# Altium project GN-1866-A-V2_HI3519V101.PRJPCB (part 4 of 4)

## Sheet P04 Power 1.SchDoc
size 420 x 297 mm
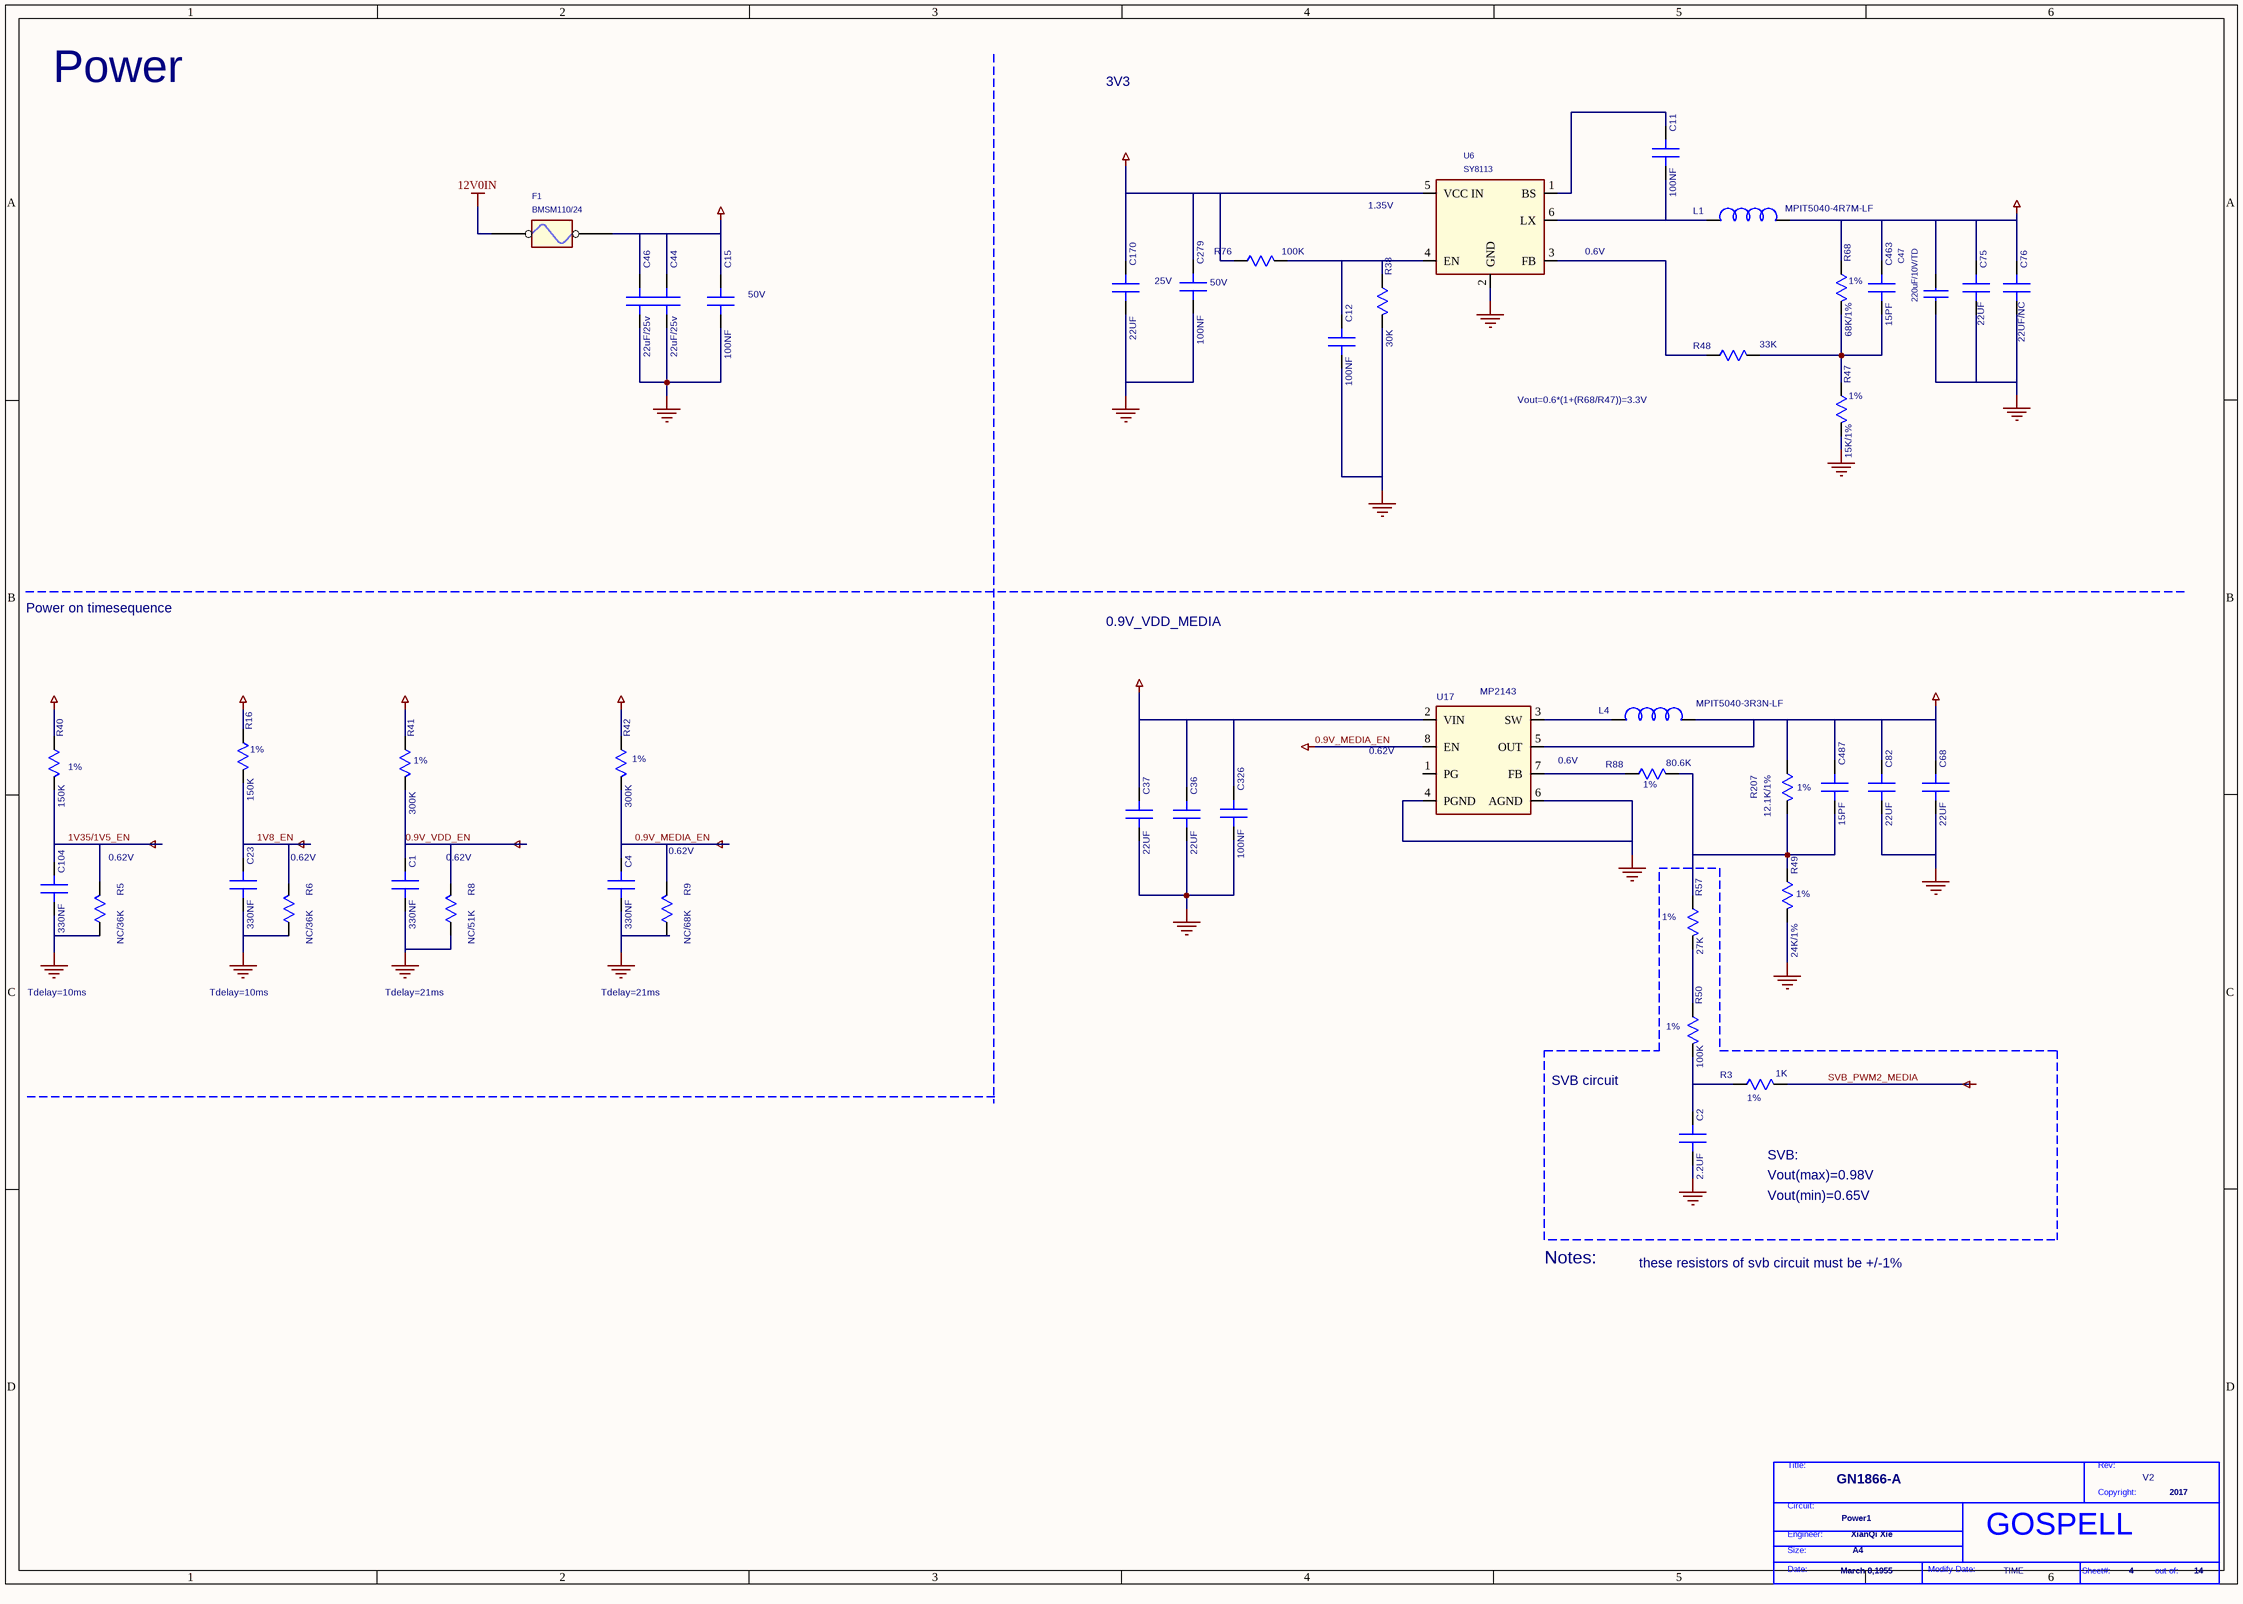
[diagram p10: P04 Power 1.SchDoc]

### Parts
(Parts that share a designator on the sheet are numbered #1, #2 ... from top to bottom, then left to right.)
*#11  Page Modify Date: TIME  Engineer: XianQi Xie  Copyright: 2017  Title: GN1866-A  RevCode: V2  Page Size: A4  Page Create Date: March 8,1955  Page Number: 4  Page Count: 14  Doc: Power1  (hidden comment: GOSPELL)  (graphical)
C1  330NF  [SC0402]
C2  2.2UF  [HSC0402]
C4  330NF  [SC0402]
C11  100NF  [SC0402]
C12  100NF  [SC0402]
C15  100NF  [SC0402]
C23  330NF  [SC0402]
C36  22UF  [SC1206]
C37  22UF  [SC1206]
C44  22uF/25v  [1210]
C46  22uF/25v  [1210]
C47  220uF/10V/TD  [C6032]
C68  22UF  [SC1206]
C75  22UF  [SC1206]
C76  22UF/NC  [SC1206]
C82  22UF  [SC1206]
C104  330NF  [SC0402]
C170  22UF  [SC1206]
C279  100NF  [SC0402]
C326  100NF  [SC0402]
C463  15PF  [SC0402]
C487  15PF  [SC0402]
F1  BMSM110/24  [1812]
L1  MPIT5040-4R7M-LF  [MPI5040]
L4  MPIT5040-3R3N-LF  [MPI5040]
R3  1K  [SR0402]
R5  NC/36K  [SR0402]
R6  NC/36K  [SR0402]
R8  NC/51K  [SR0402]
R9  NC/68K  [SR0402]
R16  150K  [SR0402]
R38  30K  [SR0402]
R40  150K  [SR0402]
R41  300K  [SR0402]
R42  300K  [SR0402]
R47  15K/1%  [SR0402]
R48  33K  [SR0402]
R49  24K/1%  [SR0402]
R50  100K  [SR0402]
R57  27K  [SR0402]
R68  68K/1%  [SR0402]
R76  100K  [SR0402]
R88  80.6K  [SR0402]
R207  12.1K/1%  [SR0402]
U6  SY8113  [SOT23-6]
U17  DEVICE: MP2143  [TSOT23-8]  (hidden comment: MP2161GJ)

### Nets
0.9V_MEDIA_EN: C4.1(A) R9.2(B) R42.2(B) U17.8(EN)
0.9V_VDD_EN: C1.1(A) R8.2(B) R41.2(B)
1V8_EN: C23.1(A) R6.2(B) R16.2(B)
1V35/1V5_EN: C104.1(A) R5.2(B) R40.2(B)
3V3: C36.1(A) C37.1(A) C47.1 C75.1(A) C76.1(A) C326.1(A) C463.1(A) L1.2(B) R16.1(A) R40.1(A) R41.1(A) R42.1(A) R68.1(A) U17.2(VIN)
12V0: C15.1(A) C44.1(A) C46.1(A) C170.1(A) C279.1(A) F1.2 R76.1(A) U6.5(VCC_IN)
12V0IN: F1.1
GND: C1.2(B) C2.2(B) C4.2(B) C12.2(B) C15.2(B) C23.2(B) C36.2(B) C37.2(B) C44.2(B) C46.2(B) C47.2 C68.2(B) C75.2(B) C76.2(B) C82.2(B) C104.2(B) C170.2(B) C279.2(B) C326.2(B) R5.1(A) R6.1(A) R8.1(A) R9.1(A) R38.2(B) R47.2(B) R49.2(B) U6.2(GND) U17.4(PGND) U17.6(AGND)
SVB_PWM2_MEDIA: R3.2(B)
VCC_MEDIA_CORE: C68.1(A) C82.1(A) C487.1(A) L4.2(B) R207.1(A) U17.5(OUT)
NetC2_1: C2.1(A) R3.1(A) R50.2(B)
NetC11_1: C11.1(A) U6.1(BS)
NetC11_2: C11.2(B) L1.1(A) U6.6(LX)
NetC12_1: C12.1(A) R38.1(A) R76.2(B) U6.4(EN)
NetC463_2: C463.2(B) R47.1(A) R48.2(B) R68.2(B)
NetC487_2: C487.2(B) R49.1(A) R57.1(A) R88.2(B) R207.2(B)
NetL4_1: L4.1(A) U17.3(SW)
NetR48_1: R48.1(A) U6.3(FB)
NetR50_1: R50.1(A) R57.2(B)
NetR88_1: R88.1(A) U17.7(FB)

Not connected (* = marked no-connect by the designer): U17 1(PG)

### Notes on the sheet
- Power
- 3V3
- (near U6) 1.35V
- (near U6) 0.6V
- (near C15) 50V
- 25V
- (near C279) 50V
- (near R68) 1%
- (near R47) 1%
- Vout=0.6*(1+(R68/R47))=3.3V
- Power on timesequence
- 0.9V_VDD_MEDIA
- (near R40) 1%
- (near R16) 1%
- (near R41) 1%
- (near R42) 1%
- (near U17) 0.62V
- (near U17) 0.6V
- (near R88) 1%
- (near R207) 1%
- (near R5) 0.62V
- 0.62V
- (near R57) 1%
- (near R49) 1%
- Tdelay=10ms
- Tdelay=21ms
- (near R50) 1%
- SVB circuit
- (near R3) 1%
- Vout(min)=0.65V
- Vout(max)=0.98V
- SVB:
- Notes:
- these resistors of svb circuit must be +/-1%
- (in symbol GOSPELL) Title:; Rev:; Copyright:; Circuit:; Engineer:; Size:; Date:; Modify Date:; Sheet#:; out of:

### Library data of the parts
C1 = C_0_Dup2: PARTS: 1; OriginalSymbolOrigin: (0,30); DEVICE: C0603C334K4RAC7867; PKG_TYPE: SC0603; LEVEL: STD; PINSWAP: (A,B); GVALUE: C 16V  0.33uF +80%~-20%  X7R 0402; CODE: 8070857; %195%%232%%202%%246%: SMD陶瓷电容-16V-330NF-+/-10%-X7R-0603-所有; %182%%238%%182%%168%%185%%164%%215%%247%%181%%231%%209%%185%(V): 16; COMPONENT_HIGH_MAX: 0.9MM; %208%%161%%192%%224%%195%%251%%179%%198%: SMD陶瓷电容
C2 = C_0_Dup2: PARTS: 1; OriginalSymbolOrigin: (0,30); DEVICE: GRM155R60J225ME15D; LEVEL: STD; PINSWAP: (A,B); CODE: 8070667; %195%%232%%202%%246%: SMD陶瓷电容-6.3V-2200NF-+/-20%-X5R-0402-TS16949; %182%%238%%182%%168%%185%%164%%215%%247%%181%%231%%209%%185%(V): 6.3; COMPONENT_HIGH_MAX: 0.6MM; %208%%161%%192%%224%%195%%251%%179%%198%: SMD陶瓷电容; GVALUE: C  6.3V  2.2uF +80%~-20%  X5R 0402; PKG_TYPE: HSC0402
C4 C23 C104 = C_0_Dup2: PARTS: 1; OriginalSymbolOrigin: (0,30); DEVICE: C0603C334K4RAC7867; PKG_TYPE: SC0603; LEVEL: STD; PINSWAP: (A,B); GVALUE: C 16V  0.33uF +80%~-20%  X7R 0402; %208%%161%%192%%224%%195%%251%%179%%198%: SMD陶瓷电容; COMPONENT_HIGH_MAX: 0.9MM; %182%%238%%182%%168%%185%%164%%215%%247%%181%%231%%209%%185%(V): 16; %195%%232%%202%%246%: SMD陶瓷电容-16V-330NF-+/-10%-X7R-0603-所有; CODE: 8070857
C11 = C_0_Dup2: PARTS: 1; OriginalSymbolOrigin: (0,30); DEVICE: RMEMK105BJ104KV_FR; LEVEL: STD; PINSWAP: (A,B); GVALUE: C 16V  0.1uF +80%~-20%  X7R 0402; %208%%161%%192%%224%%195%%251%%179%%198%: SMD陶瓷电容; COMPONENT_HIGH_MAX: 0.55MM; %182%%238%%182%%168%%185%%164%%215%%247%%181%%231%%209%%185%(V): 16; %195%%232%%202%%246%: SMD陶瓷电容-16V-100NF-+/-10%-X7R-0402-BT; CODE: 8070614; PKG_TYPE: SC0402
C12 = C_0_Dup2: PARTS: 1; OriginalSymbolOrigin: (0,30); DEVICE: RMEMK105BJ104KV_FR; LEVEL: STD; PINSWAP: (A,B); GVALUE: C 16V  0.1uF +80%~-20%  X7R 0402; CODE: 8070614; %195%%232%%202%%246%: SMD陶瓷电容-16V-100NF-+/-10%-X7R-0402-BT; %182%%238%%182%%168%%185%%164%%215%%247%%181%%231%%209%%185%(V): 16; COMPONENT_HIGH_MAX: 0.55MM; %208%%161%%192%%224%%195%%251%%179%%198%: SMD陶瓷电容; PKG_TYPE: SC0402
C15 = C_0_Dup2: PARTS: 1; OriginalSymbolOrigin: (0,30); DEVICE: C1608X7R1H104KT000N; PKG_TYPE: SC0603; LEVEL: STD; PINSWAP: (A,B); GVALUE: C 16V  0.1uF +80%~-20%  X7R 0402; CODE: 8070627; %195%%232%%202%%246%: SMD陶瓷电容-50V-100NF-+/-10%-X7R-0603; %182%%238%%182%%168%%185%%164%%215%%247%%181%%231%%209%%185%(V): 50; COMPONENT_HIGH_MAX: 0.95MM; %208%%161%%192%%224%%195%%251%%179%%198%: SMD陶瓷电容
C36 C82 = C_0_Dup2: PARTS: 1; OriginalSymbolOrigin: (0,30); DEVICE: C3216X6S0J476MTJ00N; LEVEL: STD; PINSWAP: (A,B); %208%%161%%192%%224%%195%%251%%179%%198%: SMD陶瓷电容; COMPONENT_HIGH_MAX: 1.8MM; %182%%238%%182%%168%%185%%164%%215%%247%%181%%231%%209%%185%(V): 6.3; %195%%232%%202%%246%: SMD陶瓷电容-6.3V-47000NF-+/-20%-X6S-1206-供电专用; CODE: 8071639; GVALUE: C  6.3V  22uF +80%~-20%  X5R 1206; PKG_TYPE: SC1206
C37 C68 = C_0_Dup2: PARTS: 1; OriginalSymbolOrigin: (0,30); DEVICE: CEJMK316B7226ML_T; LEVEL: STD; PINSWAP: (A,B); %208%%161%%192%%224%%195%%251%%179%%198%: SMD陶瓷电容; COMPONENT_HIGH_MAX: 1.8MM; %182%%238%%182%%168%%185%%164%%215%%247%%181%%231%%209%%185%(V): 6.3; %195%%232%%202%%246%: SMD陶瓷电容-6.3V-22000NF-+/-20%-X7R-1206-所有; CODE: 8070862; GVALUE: C  6.3V  22uF +80%~-20%  X5R 1206; PKG_TYPE: SC1206
C44 = C_0_Dup2: PARTS: 1; OriginalSymbolOrigin: (0,30); DEVICE: C1608X7R1H104KT000N; PKG_TYPE: SC0603; LEVEL: STD; PINSWAP: (A,B); %208%%161%%192%%224%%195%%251%%179%%198%: SMD陶瓷电容; COMPONENT_HIGH_MAX: 0.95MM; %182%%238%%182%%168%%185%%164%%215%%247%%181%%231%%209%%185%(V): 50; %195%%232%%202%%246%: SMD陶瓷电容-50V-100NF-+/-10%-X7R-0603; CODE: 8070627; GVALUE: C  25V  22uF +80%~-20%  X7R 1210
C46 = C_0_Dup2: PARTS: 1; OriginalSymbolOrigin: (0,30); DEVICE: C1608X7R1H104KT000N; PKG_TYPE: SC0603; LEVEL: STD; PINSWAP: (A,B); GVALUE: C  25V  22uF +80%~-20%  X7R 1210; CODE: 8070627; %195%%232%%202%%246%: SMD陶瓷电容-50V-100NF-+/-10%-X7R-0603; %182%%238%%182%%168%%185%%164%%215%%247%%181%%231%%209%%185%(V): 50; COMPONENT_HIGH_MAX: 0.95MM; %208%%161%%192%%224%%195%%251%%179%%198%: SMD陶瓷电容
C47 = CAP NP: GVALUE: CT 6.3V/220uF±20% 6032
C75 = C_0_Dup2: PARTS: 1; OriginalSymbolOrigin: (0,30); DEVICE: C3216X6S0J476MTJ00N; LEVEL: STD; PINSWAP: (A,B); CODE: 8071639; %195%%232%%202%%246%: SMD陶瓷电容-6.3V-47000NF-+/-20%-X6S-1206-供电专用; %182%%238%%182%%168%%185%%164%%215%%247%%181%%231%%209%%185%(V): 6.3; COMPONENT_HIGH_MAX: 1.8MM; %208%%161%%192%%224%%195%%251%%179%%198%: SMD陶瓷电容; GVALUE: C  6.3V  22uF +80%~-20%  X5R 1206; PKG_TYPE: SC1206
C76 = C_0_Dup2: PARTS: 1; OriginalSymbolOrigin: (0,30); DEVICE: CEJMK316B7226ML_T; LEVEL: STD; PINSWAP: (A,B); %208%%161%%192%%224%%195%%251%%179%%198%: SMD陶瓷电容; COMPONENT_HIGH_MAX: 1.8MM; %182%%238%%182%%168%%185%%164%%215%%247%%181%%231%%209%%185%(V): 6.3; %195%%232%%202%%246%: SMD陶瓷电容-6.3V-22000NF-+/-20%-X7R-1206-所有; CODE: 8070862; GVALUE: NC; PKG_TYPE: SC1206
C170 = C_0_Dup2: PARTS: 1; OriginalSymbolOrigin: (0,30); DEVICE: CETMK325B7226KM_T; PKG_TYPE: SC1210; LEVEL: STD; PINSWAP: (A,B); %208%%161%%192%%224%%195%%251%%179%%198%: SMD陶瓷电容; COMPONENT_HIGH_MAX: 2.7MM; %182%%238%%182%%168%%185%%164%%215%%247%%181%%231%%209%%185%(V): 25; %195%%232%%202%%246%: SMD陶瓷电容-25V-22000NF-+/-10%-X7R-1210-所有; CODE: 8070825; GVALUE: C  6.3V  22uF +80%~-20%  X5R 1206
C279 = C_0_Dup2: PARTS: 1; OriginalSymbolOrigin: (0,30); DEVICE: C1608X7R1H104KT000N; PKG_TYPE: SC0603; LEVEL: STD; PINSWAP: (A,B); GVALUE: C 16V  0.1uF +80%~-20%  X7R 0402; %208%%161%%192%%224%%195%%251%%179%%198%: SMD陶瓷电容; COMPONENT_HIGH_MAX: 0.9MM; %182%%238%%182%%168%%185%%164%%215%%247%%181%%231%%209%%185%(V): 50; %195%%232%%202%%246%: SMD陶瓷电容-50V-100NF-+/-10%-X7R-0603; CODE: 8070627
C326 = C_0_Dup2: PARTS: 1; OriginalSymbolOrigin: (0,30); DEVICE: C1608X7R1H104KT000N; PKG_TYPE: SC0603; LEVEL: STD; PINSWAP: (A,B); GVALUE: C 16V  0.1uF +80%~-20%  X7R 0402; CODE: 8070627; %195%%232%%202%%246%: SMD陶瓷电容-50V-100NF-+/-10%-X7R-0603; %182%%238%%182%%168%%185%%164%%215%%247%%181%%231%%209%%185%(V): 50; COMPONENT_HIGH_MAX: 0.9MM; %208%%161%%192%%224%%195%%251%%179%%198%: SMD陶瓷电容
C463 = C_0_Dup2: PARTS: 1; OriginalSymbolOrigin: (0,30); DEVICE: C0402C150J5GAC_7867; LEVEL: STD; PINSWAP: (A,B); CODE: 8070544; %195%%232%%202%%246%: SMD陶瓷电容-50V-0.015NF-+/-5%-NP0-0402; %182%%238%%182%%168%%185%%164%%215%%247%%181%%231%%209%%185%(V): 50; COMPONENT_HIGH_MAX: 0.55MM; %208%%161%%192%%224%%195%%251%%179%%198%: SMD陶瓷电容; GVALUE: C  50V  15pF +80%~-20% NP0 0402; PKG_TYPE: SC0402
C487 = C_0_Dup2: PARTS: 1; OriginalSymbolOrigin: (0,30); DEVICE: C0402C150J5GAC_7867; LEVEL: STD; PINSWAP: (A,B); %208%%161%%192%%224%%195%%251%%179%%198%: SMD陶瓷电容; COMPONENT_HIGH_MAX: 0.55MM; %182%%238%%182%%168%%185%%164%%215%%247%%181%%231%%209%%185%(V): 50; %195%%232%%202%%246%: SMD陶瓷电容-50V-0.015NF-+/-5%-NP0-0402; CODE: 8070544; GVALUE: C  50V  15pF +80%~-20% NP0 0402; PKG_TYPE: SC0402
F1 = FUSEHOLDER: GVALUE: BMSM110/24 快恢复保险PPTC 24V/1.1A 1812
L1 = L_0: PARTS: 1; OriginalSymbolOrigin: (20,20); PKG_TYPE: SL2828; LEVEL: STD; DEVICE: TGSDRH6D38_4R7N; %208%%161%%192%%224%%195%%251%%179%%198%: 贴片电感器; COMPONENT_HIGH_MAX: 4MM; %195%%232%%202%%246%: 贴片电感器-4.7UH-+/-30%-0.032OHM-4A-30DEGC MAX-7.0*7.0*4.0MM-使用温度范围包括电感温升,工艺耐温250DEGC; CODE: 10031094; GVALUE: 麦捷:MPIT5040-4R7M-LF
L4 = L_0: PARTS: 1; OriginalSymbolOrigin: (20,20); PKG_TYPE: SPL0404B; LEVEL: STD; DEVICE: NRS4018T1R0NDGJ; %208%%161%%192%%224%%195%%251%%179%%198%: 贴片电感器; COMPONENT_HIGH_MAX: 2.1MM; %195%%232%%202%%246%: 贴片电感器-1UH-30%-0.0324OHM-4A-40DEGC-4*4*2MM; CODE: 10031357; GVALUE: 麦捷:MPIT5040-3R3N-LF
R3 = R_0: PARTS: 1; OriginalSymbolOrigin: (10,20); PINSWAP: (A,B); DEVICE: RK73H1JTTD1001F; PKG_TYPE: SR0603; LEVEL: STD; %208%%161%%192%%224%%195%%251%%179%%198%: 片式厚膜电阻器; COMPONENT_HIGH_MAX: 0.55MM; %215%%232%%214%%181%%212%%202%%208%%237%%198%%171%%178%%238%: +/-1%; %182%%238%%182%%168%%185%%166%%194%%202%(W): 0.1; %195%%232%%202%%246%: 片式厚膜电阻器-0.1W-1000OHM-+/-1%-0603; CODE: 7090885; GVALUE: R 1/16W 1K±5% 0402
R5 R8 = R_0: PARTS: 1; OriginalSymbolOrigin: (10,20); PINSWAP: (A,B); DEVICE: RC0603JR_07510R; PKG_TYPE: SR0603; LEVEL: STD; CODE: 7090638; %195%%232%%202%%246%: 片式厚膜电阻器-0.1W-510OHM-+/-5%-0603; %182%%238%%182%%168%%185%%166%%194%%202%(W): 0.1; %215%%232%%214%%181%%212%%202%%208%%237%%198%%171%%178%%238%: +/-5%; COMPONENT_HIGH_MAX: 0.55MM; %208%%161%%192%%224%%195%%251%%179%%198%: 片式厚膜电阻器; GVALUE: NC
R6 R9 = R_0: PARTS: 1; OriginalSymbolOrigin: (10,20); PINSWAP: (A,B); DEVICE: RC0603JR_07510R; PKG_TYPE: SR0603; LEVEL: STD; %208%%161%%192%%224%%195%%251%%179%%198%: 片式厚膜电阻器; COMPONENT_HIGH_MAX: 0.55MM; %215%%232%%214%%181%%212%%202%%208%%237%%198%%171%%178%%238%: +/-5%; %182%%238%%182%%168%%185%%166%%194%%202%(W): 0.1; %195%%232%%202%%246%: 片式厚膜电阻器-0.1W-510OHM-+/-5%-0603; CODE: 7090638; GVALUE: NC
R16 = R_0: PARTS: 1; OriginalSymbolOrigin: (10,20); PINSWAP: (A,B); DEVICE: RK73B1ELTP104J; LEVEL: STD; GVALUE: R 1/16W 150K±5% 0402; %208%%161%%192%%224%%195%%251%%179%%198%: 片式厚膜电阻器; COMPONENT_HIGH_MAX: 0.4MM; %215%%232%%214%%181%%212%%202%%208%%237%%198%%171%%178%%238%: +/-5%; %182%%238%%182%%168%%185%%166%%194%%202%(W): 0.06; %195%%232%%202%%246%: 片式厚膜电阻器-0.0625W-100000OHM-+/-5%-0402-BT; CODE: 7090831; PKG_TYPE: SR0402
R38 = R_0: PARTS: 1; OriginalSymbolOrigin: (10,20); PINSWAP: (A,B); DEVICE: RK73B1ELTP104J; LEVEL: STD; CODE: 7090831; %195%%232%%202%%246%: 片式厚膜电阻器-0.0625W-100000OHM-+/-5%-0402-BT; %182%%238%%182%%168%%185%%166%%194%%202%(W): 0.06; %215%%232%%214%%181%%212%%202%%208%%237%%198%%171%%178%%238%: +/-5%; COMPONENT_HIGH_MAX: 0.37MM; %208%%161%%192%%224%%195%%251%%179%%198%: 片式厚膜电阻器; GVALUE: R 1/16W 30K±5% 0402; PKG_TYPE: SR0402
R40 = R_0: PARTS: 1; OriginalSymbolOrigin: (10,20); PINSWAP: (A,B); DEVICE: RK73B1ELTP104J; LEVEL: STD; %208%%161%%192%%224%%195%%251%%179%%198%: 片式厚膜电阻器; COMPONENT_HIGH_MAX: 0.4MM; %215%%232%%214%%181%%212%%202%%208%%237%%198%%171%%178%%238%: +/-5%; %182%%238%%182%%168%%185%%166%%194%%202%(W): 0.06; %195%%232%%202%%246%: 片式厚膜电阻器-0.0625W-100000OHM-+/-5%-0402-BT; CODE: 7090831; GVALUE: R 1/16W 150K±5% 0402; PKG_TYPE: SR0402
R41 = R_0: PARTS: 1; OriginalSymbolOrigin: (10,20); PINSWAP: (A,B); DEVICE: RC0402JR_07220K; LEVEL: STD; CODE: 7090608; %195%%232%%202%%246%: 片式厚膜电阻器-0.0625W-220000OHM-+/-5%-0402; %182%%238%%182%%168%%185%%166%%194%%202%(W): 0.06; %215%%232%%214%%181%%212%%202%%208%%237%%198%%171%%178%%238%: +/-5%; COMPONENT_HIGH_MAX: 0.4MM; %208%%161%%192%%224%%195%%251%%179%%198%: 片式厚膜电阻器; GVALUE: R 1/16W 300K±5% 0402; PKG_TYPE: SR0402
R42 = R_0: PARTS: 1; OriginalSymbolOrigin: (10,20); PINSWAP: (A,B); DEVICE: RC0603JR_07300K; PKG_TYPE: SR0603; LEVEL: STD; %208%%161%%192%%224%%195%%251%%179%%198%: 片式厚膜电阻器; COMPONENT_HIGH_MAX: 0.55MM; %215%%232%%214%%181%%212%%202%%208%%237%%198%%171%%178%%238%: +/-5%; %182%%238%%182%%168%%185%%166%%194%%202%(W): 0.1; %195%%232%%202%%246%: 片式厚膜电阻器-0.1W-300000OHM-+/-5%-0603; CODE: 7090261; GVALUE: R 1/16W 300K±5% 0402
R47 = R_0: PARTS: 1; OriginalSymbolOrigin: (10,20); PINSWAP: (A,B); DEVICE: RC0603FR_0710K7; PKG_TYPE: SR0603; LEVEL: STD; %208%%161%%192%%224%%195%%251%%179%%198%: 片式厚膜电阻器; COMPONENT_HIGH_MAX: 0.55MM; %215%%232%%214%%181%%212%%202%%208%%237%%198%%171%%178%%238%: +/-1%; %182%%238%%182%%168%%185%%166%%194%%202%(W): 0.1; %195%%232%%202%%246%: 片式厚膜电阻器-0.1W-10700OHM-+/-1%-0603; CODE: 7090969; GVALUE: R 1/16W 15K±1% 0402
R48 = R_0: PARTS: 1; OriginalSymbolOrigin: (10,20); PINSWAP: (A,B); DEVICE: RK73B1ELTP333J; LEVEL: STD; CODE: 7090828; %195%%232%%202%%246%: 片式厚膜电阻器-0.0625W-33000OHM-+/-5%-0402; %182%%238%%182%%168%%185%%166%%194%%202%(W): 0.06; %215%%232%%214%%181%%212%%202%%208%%237%%198%%171%%178%%238%: +/-5%; COMPONENT_HIGH_MAX: 0.4MM; %208%%161%%192%%224%%195%%251%%179%%198%: 片式厚膜电阻器; GVALUE: R 1/16W 33K±1% 0402; PKG_TYPE: SR0402
R49 = R_0: PARTS: 1; OriginalSymbolOrigin: (10,20); PINSWAP: (A,B); DEVICE: RC_02W2402FT; LEVEL: STD; CODE: 7091376; %195%%232%%202%%246%: 片式厚膜电阻器-0.0625W-24000OHM-+/-1%-0402; %182%%238%%182%%168%%185%%166%%194%%202%(W): 0.06; %215%%232%%214%%181%%212%%202%%208%%237%%198%%171%%178%%238%: +/-1%; COMPONENT_HIGH_MAX: 0.4MM; %208%%161%%192%%224%%195%%251%%179%%198%: 片式厚膜电阻器; GVALUE: R 1/16W 24K±1% 0402; PKG_TYPE: SR0402
R50 = R_0: PARTS: 1; OriginalSymbolOrigin: (10,20); PINSWAP: (A,B); DEVICE: RK73H1JTTD1003F; PKG_TYPE: SR0603; LEVEL: STD; CODE: 7090941; %195%%232%%202%%246%: 片式厚膜电阻器-0.1W-100000OHM-+/-1%-0603; %182%%238%%182%%168%%185%%166%%194%%202%(W): 0.1; %215%%232%%214%%181%%212%%202%%208%%237%%198%%171%%178%%238%: +/-1%; COMPONENT_HIGH_MAX: 0.55MM; %208%%161%%192%%224%%195%%251%%179%%198%: 片式厚膜电阻器; GVALUE: R 1/16W 100K±5% 0402
R57 = R_0: PARTS: 1; OriginalSymbolOrigin: (10,20); PINSWAP: (A,B); DEVICE: RK73H1JTTD2702F; PKG_TYPE: SR0603; LEVEL: STD; %208%%161%%192%%224%%195%%251%%179%%198%: 片式厚膜电阻器; COMPONENT_HIGH_MAX: 0.55MM; %215%%232%%214%%181%%212%%202%%208%%237%%198%%171%%178%%238%: +/-1%; %182%%238%%182%%168%%185%%166%%194%%202%(W): 0.1; %195%%232%%202%%246%: 片式厚膜电阻器-0.1W-27000OHM-+/-1%-0603; CODE: 7090937; GVALUE: R 1/16W 27K±5% 0402
R68 = R_0: PARTS: 1; OriginalSymbolOrigin: (10,20); PINSWAP: (A,B); DEVICE: RC0603FR_0733K2; PKG_TYPE: SR0603; LEVEL: STD; GVALUE: R 1/16W 68K±1% 0402; CODE: 7090766; %195%%232%%202%%246%: 片式厚膜电阻器-0.1W-33200OHM-+/-1%-0603; %182%%238%%182%%168%%185%%166%%194%%202%(W): 0.1; %215%%232%%214%%181%%212%%202%%208%%237%%198%%171%%178%%238%: +/-1%; COMPONENT_HIGH_MAX: 0.55MM; %208%%161%%192%%224%%195%%251%%179%%198%: 片式厚膜电阻器
R76 = R_0: PARTS: 1; OriginalSymbolOrigin: (10,20); PINSWAP: (A,B); DEVICE: RK73B1ELTP104J; LEVEL: STD; CODE: 7090831; %195%%232%%202%%246%: 片式厚膜电阻器-0.0625W-100000OHM-+/-5%-0402-BT; %182%%238%%182%%168%%185%%166%%194%%202%(W): 0.06; %215%%232%%214%%181%%212%%202%%208%%237%%198%%171%%178%%238%: +/-5%; COMPONENT_HIGH_MAX: 0.37MM; %208%%161%%192%%224%%195%%251%%179%%198%: 片式厚膜电阻器; GVALUE: R 1/16W 100K±5% 0402; PKG_TYPE: SR0402
R88 = R_0: PARTS: 1; OriginalSymbolOrigin: (10,20); PINSWAP: (A,B); DEVICE: RK73H1JTTD8062F; PKG_TYPE: SR0603; LEVEL: STD; GVALUE: R 1/16W 80.6K±1% 0402; CODE: 7090931; %195%%232%%202%%246%: 片式厚膜电阻器-0.1W-80600OHM-+/-1%-0603; %182%%238%%182%%168%%185%%166%%194%%202%(W): 0.1; COMPONENT_HIGH_MAX: 0.55MM; %208%%161%%192%%224%%195%%251%%179%%198%: 片式厚膜电阻器
R207 = R_0: PARTS: 1; OriginalSymbolOrigin: (10,20); PINSWAP: (A,B); DEVICE: RK73H1JTTD1272F; PKG_TYPE: SR0603; LEVEL: STD; CODE: 7090924; %195%%232%%202%%246%: 片式厚膜电阻器-0.1W-12700OHM-+/-1%-0603; %182%%238%%182%%168%%185%%166%%194%%202%(W): 0.1; %215%%232%%214%%181%%212%%202%%208%%237%%198%%171%%178%%238%: +/-1%; COMPONENT_HIGH_MAX: 0.55MM; %208%%161%%192%%224%%195%%251%%179%%198%: 片式厚膜电阻器; GVALUE: R 1/16W 12.1K±1% 0402
U6 = SY8120: GVALUE: 电源调整管 SY8113 SOT23-6
U17 = MP2161GJ_0: PARTS: 1; OriginalSymbolOrigin: (20,90); LEVEL: STD; COMPONENT_HIGH_MAX: 1MM; CODE: HBVT4016; GVALUE: 电源调整管 MP2161GJ TSOT23-8; FORWARD_PCB: 1; PKG_TYPE: TSOT23-8; %195%%232%%202%%246%: MP2143
*#11 = GOSPELL: Cage Code: 2017

## Sheet P03 Power Tree.SchDoc
size 297 x 209 mm
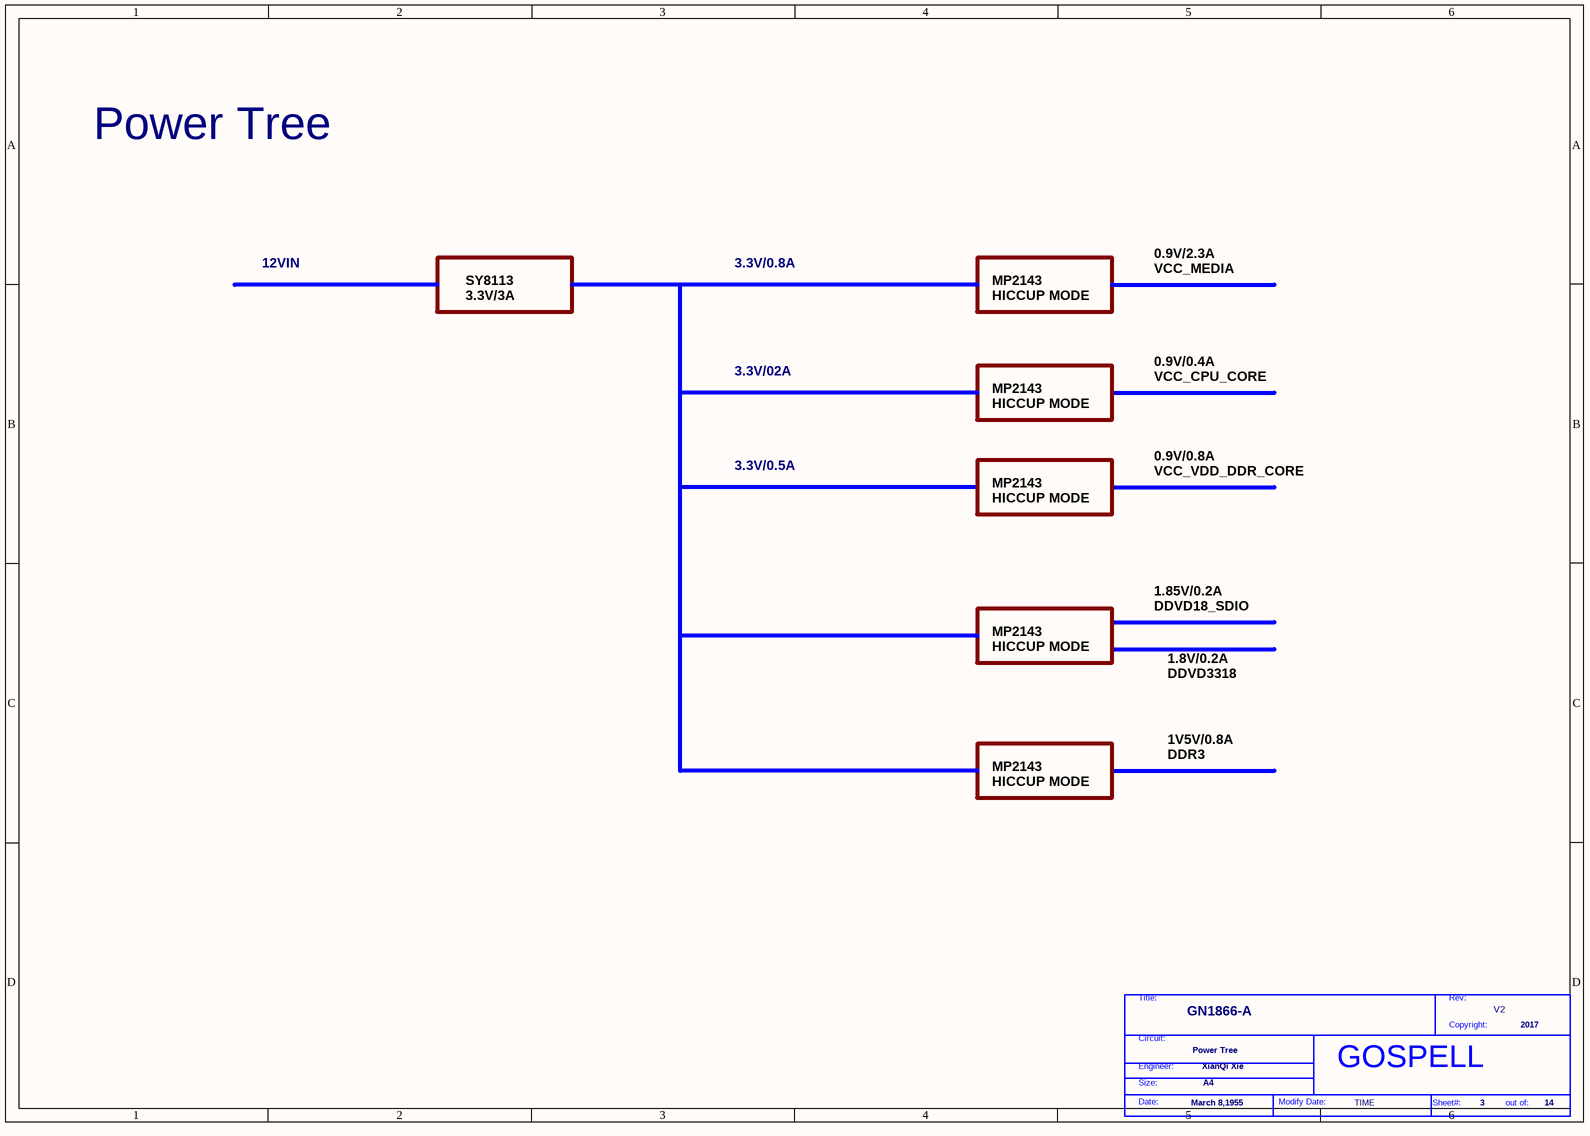
[diagram p11: P03 Power Tree.SchDoc]

### Parts
(Parts that share a designator on the sheet are numbered #1, #2 ... from top to bottom, then left to right.)
*#12  Page Modify Date: TIME  Engineer: XianQi Xie  Copyright: 2017  Title: GN1866-A  RevCode: V2  Page Size: A4  Page Create Date: March 8,1955  Page Number: 3  Page Count: 14  Doc: Power Tree  (hidden comment: GOSPELL)  (graphical)

### Notes on the sheet
- Power Tree
- 12VIN
- SY8113
  3.3V/3A
- 3.3V/0.8A
- MP2143
  HICCUP MODE
- 0.9V/2.3A
  VCC_MEDIA
- 3.3V/02A
- 0.9V/0.4A
  VCC_CPU_CORE
- 3.3V/0.5A
- 0.9V/0.8A
  VCC_VDD_DDR_CORE
- 1.85V/0.2A
  DDVD18_SDIO
- 1.8V/0.2A
  DDVD3318
- 1V5V/0.8A
  DDR3
- (in symbol GOSPELL) Title:; Rev:; Copyright:; Circuit:; Engineer:; Size:; Date:; Modify Date:; Sheet#:; out of:

### Library data of the parts
*#12 = GOSPELL: Cage Code: 2017

## Sheet P02 Block Diagram.SchDoc
size 297 x 209 mm
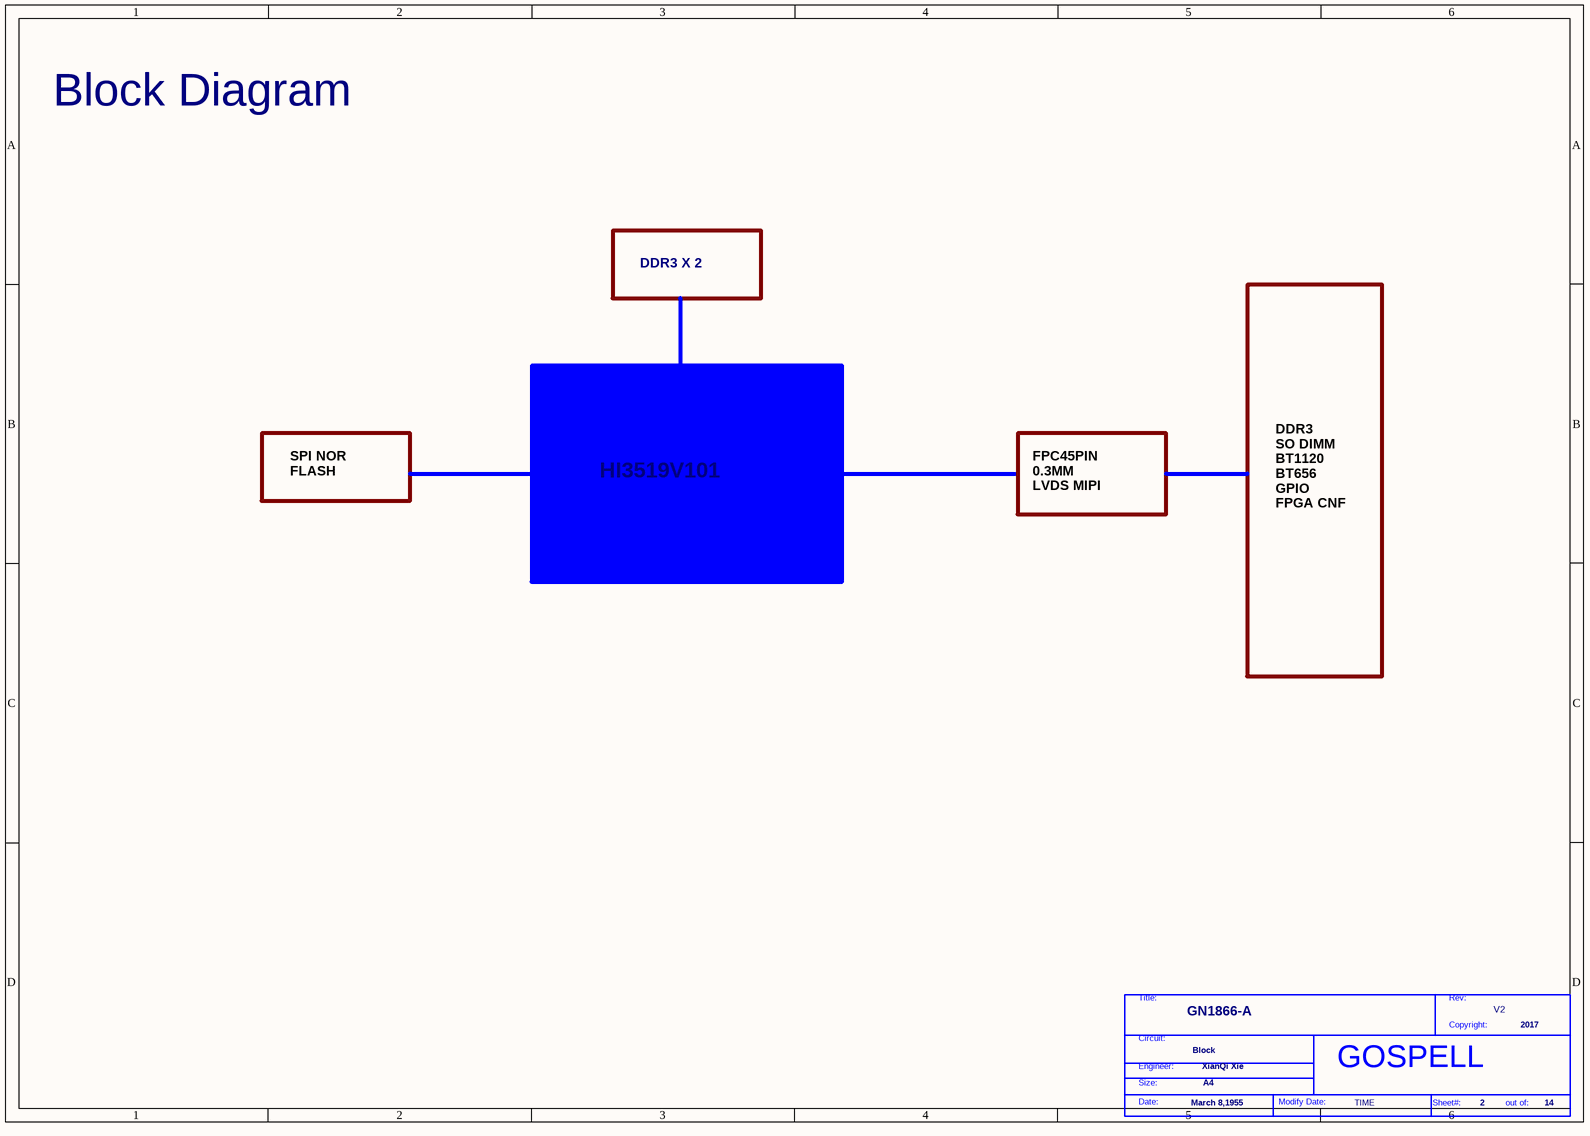
[diagram p12: P02 Block Diagram.SchDoc]

### Parts
(Parts that share a designator on the sheet are numbered #1, #2 ... from top to bottom, then left to right.)
*#13  Page Modify Date: TIME  Engineer: XianQi Xie  Copyright: 2017  Title: GN1866-A  RevCode: V2  Page Size: A4  Page Create Date: March 8,1955  Page Number: 2  Page Count: 14  Doc: Block  (hidden comment: GOSPELL)  (graphical)

### Notes on the sheet
- Block Diagram
- DDR3 X 2
- SPI NOR
  FLASH
- FPC45PIN
  0.3MM
  LVDS MIPI
- DDR3
  SO DIMM
  BT1120
  BT656
  GPIO
  FPGA CNF
- HI3519V101
- (in symbol GOSPELL) Title:; Rev:; Copyright:; Circuit:; Engineer:; Size:; Date:; Modify Date:; Sheet#:; out of:

### Library data of the parts
*#13 = GOSPELL: Cage Code: 2017

## Sheet P01 Note & Title.SchDoc
size 297 x 209 mm
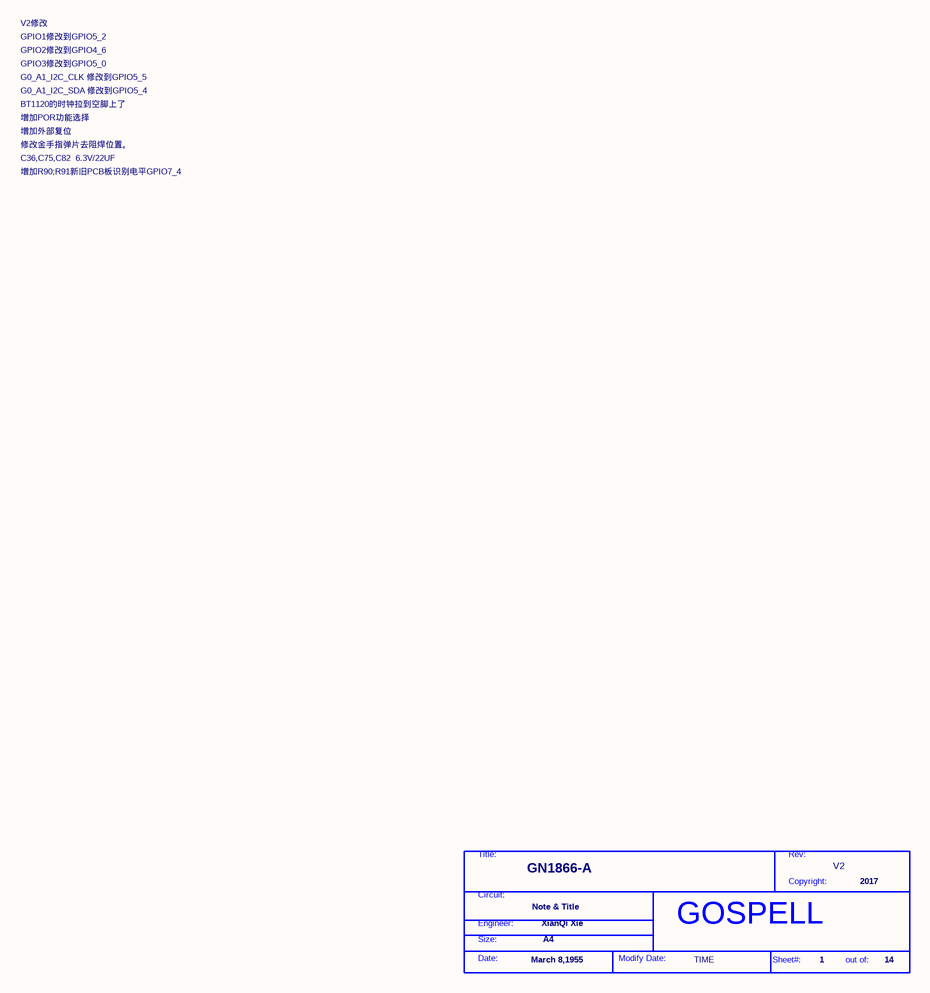
[diagram p13: P01 Note & Title.SchDoc]

### Parts
(Parts that share a designator on the sheet are numbered #1, #2 ... from top to bottom, then left to right.)
*#14  Page Modify Date: TIME  Engineer: XianQi Xie  Copyright: 2017  Title: GN1866-A  RevCode: V2  Page Size: A4  Page Create Date: March 8,1955  Page Number: 1  Page Count: 14  Doc: Note & Title  (hidden comment: GOSPELL)  (graphical)

### Notes on the sheet
- GPIO2修改到GPIO4_6
- V2修改
- GPIO1修改到GPIO5_2
- G0_A1_I2C_CLK 修改到GPIO5_5
- BT1120的时钟拉到空脚上了
- G0_A1_I2C_SDA 修改到GPIO5_4
- GPIO3修改到GPIO5_0
- 增加POR功能选择
- 增加外部复位
- 修改金手指弹片去阻焊位置。
- C36,C75,C82  6.3V/22UF
- 增加R90;R91新旧PCB板识别电平GPIO7_4
- (in symbol GOSPELL) Title:; Rev:; Copyright:; Circuit:; Engineer:; Size:; Date:; Modify Date:; Sheet#:; out of:

### Library data of the parts
*#14 = GOSPELL: Cage Code: 2017

## Nets that join several sheets
0.9V_VDD_EN: P05 Power 2 (U1.8 U2.8), P04 Power 1 (C1.1 R8.2 R41.2)
1V8: P12 Spi Nor Flash (R2.1), P11 Peripheral of Hi351 (R44.2), P10 VI Hi3519 (R14.1), P06 Power&GND of Hi3519 (LB1.1), P05 Power 2 (5 pins)
1V8_EN: P05 Power 2 (U21.8), P04 Power 1 (C23.1 R6.2 R16.2)
1V35/1V5: P08 DDR3 (60 pins), P06 Power&GND of Hi3519 (18 pins), P05 Power 2 (5 pins)
1V35/1V5_EN: P05 Power 2 (U22.8), P04 Power 1 (C104.1 R5.2 R40.2)
3V3: P14 LED (5 pins), P12 Spi Nor Flash (R4.1), P11 Peripheral of Hi351 (13 pins), P10 VI Hi3519 (7 pins), P06 Power&GND of Hi3519 (7 pins), P05 Power 2 (12 pins), P04 Power 1 (14 pins)
3V3/1V8: P12 Spi Nor Flash (10 pins), P09 SYS of Hi3519 (18 pins)
12V0IN: P13 CONNECT (6 pins), P04 Power 1 (F1.1)
DDR_A0: P08 DDR3 (U19.N3 U26.N3), P07 DDRC of Hi3519 (U3.C1)
DDR_A1: P08 DDR3 (U19.P7 U26.P7), P07 DDRC of Hi3519 (U3.D2)
DDR_A2: P08 DDR3 (U19.P3 U26.P3), P07 DDRC of Hi3519 (U3.J2)
DDR_A3: P08 DDR3 (U19.N2 U26.N2), P07 DDRC of Hi3519 (U3.C2)
DDR_A4: P08 DDR3 (U19.P8 U26.P8), P07 DDRC of Hi3519 (U3.E1)
DDR_A5: P08 DDR3 (U19.P2 U26.P2), P07 DDRC of Hi3519 (U3.G2)
DDR_A6: P08 DDR3 (U19.R8 U26.R8), P07 DDRC of Hi3519 (U3.H2)
DDR_A7: P08 DDR3 (U19.R2 U26.R2), P07 DDRC of Hi3519 (U3.J1)
DDR_A8: P08 DDR3 (U19.T8 U26.T8), P07 DDRC of Hi3519 (U3.H1)
DDR_A9: P08 DDR3 (U19.R3 U26.R3), P07 DDRC of Hi3519 (U3.E2)
DDR_A10: P08 DDR3 (U19.L7 U26.L7), P07 DDRC of Hi3519 (U3.F4)
DDR_A11: P08 DDR3 (U19.R7 U26.R7), P07 DDRC of Hi3519 (U3.H3)
DDR_A12: P08 DDR3 (U19.N7 U26.N7), P07 DDRC of Hi3519 (U3.K4)
DDR_A13: P08 DDR3 (U19.T3 U26.T3), P07 DDRC of Hi3519 (U3.K3)
DDR_A14: P08 DDR3 (U19.T7 U26.T7), P07 DDRC of Hi3519 (U3.C3)
DDR_A15: P08 DDR3 (U19.M7 U26.M7), P07 DDRC of Hi3519 (U3.J4)
DDR_BA0: P08 DDR3 (U19.M2 U26.M2), P07 DDRC of Hi3519 (U3.J5)
DDR_BA1: P08 DDR3 (U19.N8 U26.N8), P07 DDRC of Hi3519 (U3.G3)
DDR_BA2: P08 DDR3 (U19.M3 U26.M3), P07 DDRC of Hi3519 (U3.K5)
DDR_CAS_N: P08 DDR3 (U19.K3 U26.K3), P07 DDRC of Hi3519 (U3.E4)
DDR_CKE0: P08 DDR3 (U19.K9 U26.K9), P07 DDRC of Hi3519 (U3.D3)
DDR_CLK_N: P08 DDR3 (R7.1 U19.K7 U26.K7), P07 DDRC of Hi3519 (U3.B1)
DDR_CLK_P: P08 DDR3 (R7.2 U19.J7 U26.J7), P07 DDRC of Hi3519 (U3.B2)
DDR_CS0_N: P08 DDR3 (U19.L2 U26.L2), P07 DDRC of Hi3519 (U3.F1)
DDR_DM0: P08 DDR3 (U19.E7), P07 DDRC of Hi3519 (U3.D17)
DDR_DM1: P08 DDR3 (U19.D3), P07 DDRC of Hi3519 (U3.D13)
DDR_DM2: P08 DDR3 (U26.E7), P07 DDRC of Hi3519 (U3.E10)
DDR_DM3: P08 DDR3 (U26.D3), P07 DDRC of Hi3519 (U3.E6)
DDR_DQ0: P08 DDR3 (U19.E3), P07 DDRC of Hi3519 (U3.A16)
DDR_DQ1: P08 DDR3 (U19.F7), P07 DDRC of Hi3519 (U3.B13)
DDR_DQ2: P08 DDR3 (U19.F2), P07 DDRC of Hi3519 (U3.B16)
DDR_DQ3: P08 DDR3 (U19.F8), P07 DDRC of Hi3519 (U3.A13)
DDR_DQ4: P08 DDR3 (U19.H3), P07 DDRC of Hi3519 (U3.C15)
DDR_DQ5: P08 DDR3 (U19.H8), P07 DDRC of Hi3519 (U3.C14)
DDR_DQ6: P08 DDR3 (U19.G2), P07 DDRC of Hi3519 (U3.C16)
DDR_DQ7: P08 DDR3 (U19.H7), P07 DDRC of Hi3519 (U3.E17)
DDR_DQ8: P08 DDR3 (U19.D7), P07 DDRC of Hi3519 (U3.A10)
DDR_DQ9: P08 DDR3 (U19.C3), P07 DDRC of Hi3519 (U3.E13)
DDR_DQ10: P08 DDR3 (U19.C8), P07 DDRC of Hi3519 (U3.B10)
DDR_DQ11: P08 DDR3 (U19.C2), P07 DDRC of Hi3519 (U3.E14)
DDR_DQ12: P08 DDR3 (U19.A7), P07 DDRC of Hi3519 (U3.C12)
DDR_DQ13: P08 DDR3 (U19.A2), P07 DDRC of Hi3519 (U3.D14)
DDR_DQ14: P08 DDR3 (U19.B8), P07 DDRC of Hi3519 (U3.C11)
DDR_DQ15: P08 DDR3 (U19.A3), P07 DDRC of Hi3519 (U3.C13)
DDR_DQ16: P08 DDR3 (U26.E3), P07 DDRC of Hi3519 (U3.C10)
DDR_DQ17: P08 DDR3 (U26.F7), P07 DDRC of Hi3519 (U3.A8)
DDR_DQ18: P08 DDR3 (U26.F2), P07 DDRC of Hi3519 (U3.C9)
DDR_DQ19: P08 DDR3 (U26.F8), P07 DDRC of Hi3519 (U3.E9)
DDR_DQ20: P08 DDR3 (U26.H3), P07 DDRC of Hi3519 (U3.B8)
DDR_DQ21: P08 DDR3 (U26.H8), P07 DDRC of Hi3519 (U3.D10)
DDR_DQ22: P08 DDR3 (U26.G2), P07 DDRC of Hi3519 (U3.C8)
DDR_DQ23: P08 DDR3 (U26.H7), P07 DDRC of Hi3519 (U3.C7)
DDR_DQ24: P08 DDR3 (U26.D7), P07 DDRC of Hi3519 (U3.B3)
DDR_DQ25: P08 DDR3 (U26.C3), P07 DDRC of Hi3519 (U3.D6)
DDR_DQ26: P08 DDR3 (U26.C8), P07 DDRC of Hi3519 (U3.C5)
DDR_DQ27: P08 DDR3 (U26.C2), P07 DDRC of Hi3519 (U3.D9)
DDR_DQ28: P08 DDR3 (U26.A7), P07 DDRC of Hi3519 (U3.C6)
DDR_DQ29: P08 DDR3 (U26.A2), P07 DDRC of Hi3519 (U3.A3)
DDR_DQ30: P08 DDR3 (U26.B8), P07 DDRC of Hi3519 (U3.A4)
DDR_DQ31: P08 DDR3 (U26.A3), P07 DDRC of Hi3519 (U3.B4)
DDR_DQS0_N: P08 DDR3 (U19.G3), P07 DDRC of Hi3519 (U3.A14)
DDR_DQS0_P: P08 DDR3 (U19.F3), P07 DDRC of Hi3519 (U3.B14)
DDR_DQS1_N: P08 DDR3 (U19.B7), P07 DDRC of Hi3519 (U3.A11)
DDR_DQS1_P: P08 DDR3 (U19.C7), P07 DDRC of Hi3519 (U3.B11)
DDR_DQS2_N: P08 DDR3 (U26.G3), P07 DDRC of Hi3519 (U3.A7)
DDR_DQS2_P: P08 DDR3 (U26.F3), P07 DDRC of Hi3519 (U3.B7)
DDR_DQS3_N: P08 DDR3 (U26.B7), P07 DDRC of Hi3519 (U3.A5)
DDR_DQS3_P: P08 DDR3 (U26.C7), P07 DDRC of Hi3519 (U3.B5)
DDR_ODT: P08 DDR3 (U19.K1 U26.K1), P07 DDRC of Hi3519 (U3.F3)
DDR_RAS_N: P08 DDR3 (U19.J3 U26.J3), P07 DDRC of Hi3519 (U3.D4)
DDR_RESET_N: P08 DDR3 (C74.1 C137.1 U19.T2 U26.T2), P07 DDRC of Hi3519 (U3.J3)
DDR_WE_N: P08 DDR3 (U19.L3 U26.L3), P07 DDRC of Hi3519 (U3.F5)
GND: P14 LED (6 pins), P13 CONNECT (55 pins), P12 Spi Nor Flash (26 pins), P11 Peripheral of Hi351 (25 pins), P10 VI Hi3519 (10 pins), P09 SYS of Hi3519 (24 pins), P08 DDR3 (74 pins), P07 DDRC of Hi3519 (R261.2), P06 Power&GND of Hi3519 (198 pins), P05 Power 2 (30 pins), P04 Power 1 (29 pins)
LED1_GREEN: P14 LED (R87.1), P10 VI Hi3519 (U3.B23)
SFC_CLK: P12 Spi Nor Flash (U18.6 U20.16), P09 SYS of Hi3519 (R21.1)
SFC_CSN0: P12 Spi Nor Flash (R73.1 U18.1 U20.7), P09 SYS of Hi3519 (U3.U3)
SFC_HOLD_IO3: P12 Spi Nor Flash (R127.2 U20.1), P09 SYS of Hi3519 (U3.AA3)
SFC_MISO_IO1: P12 Spi Nor Flash (U18.2 U20.8), P09 SYS of Hi3519 (U3.Y2)
SFC_MOSI_IO0: P12 Spi Nor Flash (U18.5 U20.15), P09 SYS of Hi3519 (U3.V1)
SFC_WP_IO2: P12 Spi Nor Flash (R216.2 U18.3 U20.9), P09 SYS of Hi3519 (U3.W2)
SVB_PWM0_VDD: P11 Peripheral of Hi351 (U3.AA19), P05 Power 2 (R202.2)
SVB_PWM2_MEDIA: P11 Peripheral of Hi351 (U3.AC19), P04 Power 1 (R3.2)
SVB_PWM3_CPU: P11 Peripheral of Hi351 (U3.AD19), P05 Power 2 (R83.2)
SYS_RSTN_OUT: P12 Spi Nor Flash (C212.1 U18.7 U20.3), P09 SYS of Hi3519 (R80.1 U3.AA1)
VCC_CPU_CORE: P06 Power&GND of Hi3519 (12 pins), P05 Power 2 (5 pins)
VCC_MEDIA_CORE: P06 Power&GND of Hi3519 (26 pins), P04 Power 1 (6 pins)
VCC_VDD_DDR_CORE: P11 Peripheral of Hi351 (C40.1 U3.H18), P09 SYS of Hi3519 (C314.1 LB8.2), P06 Power&GND of Hi3519 (17 pins), P05 Power 2 (5 pins)
EPHY_CLK: P13 CONNECT (J1.164), P09 SYS of Hi3519 (R22.1)
EPHY_RSTN: P13 CONNECT (J1.172), P09 SYS of Hi3519 (R61.1 U3.D19)
F_SYSTEM: P13 CONNECT (J1.2), P09 SYS of Hi3519 (U3.AC24)
FA_I2S_BCLK: P13 CONNECT (R378.2), P10 VI Hi3519 (U3.AC22)
FA_I2S_DA0: P13 CONNECT (R376.2), P09 SYS of Hi3519 (U3.AD22)
FA_I2S_LRCLK: P13 CONNECT (R377.2), P10 VI Hi3519 (U3.AB21)
G0_A1_I2C_CLK: P13 CONNECT (R393.1), P11 Peripheral of Hi351 (U3.U21)
G0_A1_I2C_SDA: P13 CONNECT (R392.1), P11 Peripheral of Hi351 (U3.R21)
G0_A2_I2C_CLK: P13 CONNECT (R391.1), P11 Peripheral of Hi351 (U3.L22)
G0_A2_I2C_SDA: P13 CONNECT (R390.1), P11 Peripheral of Hi351 (U3.K23)
G2_A1_I2C_CLK: P13 CONNECT (R381.1), P11 Peripheral of Hi351 (U3.K24)
G2_A1_I2C_SDA: P13 CONNECT (R387.1), P11 Peripheral of Hi351 (U3.M23)
G2_A2_I2C_CLK: P13 CONNECT (R383.1), P11 Peripheral of Hi351 (R82.2 U3.AA20)
G2_A2_I2C_SDA: P13 CONNECT (R379.1), P11 Peripheral of Hi351 (R33.2 U3.AA21)
M0_CKM_VI0_D8: P13 CONNECT (MIPI1.11 R10.2), P10 VI Hi3519 (U3.AA6)
M0_CKP_VI0_D7: P13 CONNECT (MIPI1.10 R58.2), P10 VI Hi3519 (U3.AB6)
M0_D0M_VI0_VS: P13 CONNECT (MIPI1.5), P10 VI Hi3519 (U3.AC5)
M0_D0P_VI0_D0: P13 CONNECT (MIPI1.4 R71.2), P10 VI Hi3519 (U3.AD5)
M0_D1M_VI0_HS: P13 CONNECT (MIPI1.2), P10 VI Hi3519 (U3.AD4)
M0_D1P_VI0_CK: P13 CONNECT (MIPI1.1 R59.2), P10 VI Hi3519 (U3.AC4)
M0_D2M_VI0_D1: P13 CONNECT (MIPI1.14 R45.2), P10 VI Hi3519 (U3.AC6)
M0_D2P_VI0_D2: P13 CONNECT (MIPI1.13 R46.2), P10 VI Hi3519 (U3.AD6)
M0_D3M_VI0_D5: P13 CONNECT (MIPI1.8 R55.2), P10 VI Hi3519 (U3.AA5)
M0_D3P_VI0_D6: P13 CONNECT (MIPI1.7 R56.2), P10 VI Hi3519 (U3.AB5)
M1_CKM_VI0_D4: P13 CONNECT (MIPI1.23 R54.2), P10 VI Hi3519 (U3.AD9)
M1_CKP_VI0_D3: P13 CONNECT (MIPI1.22 R53.2), P10 VI Hi3519 (U3.AC9)
M1_D0M_VI0_D15: P13 CONNECT (MIPI1.26 R35.2), P10 VI Hi3519 (U3.AC10)
M1_D0P: P13 CONNECT (MIPI1.25), P10 VI Hi3519 (U3.AD10)
M1_D1M_VI0_D14: P13 CONNECT (MIPI1.20 R34.2), P10 VI Hi3519 (U3.AD8)
M1_D1P_VI0_D13: P13 CONNECT (MIPI1.19 R31.2), P10 VI Hi3519 (U3.AC8)
M1_D2M_VI0_D11: P13 CONNECT (MIPI1.29 R19.2), P10 VI Hi3519 (U3.AA9)
M1_D2P_VI0_D12: P13 CONNECT (MIPI1.28 R30.2), P10 VI Hi3519 (U3.AB9)
M1_D3M_VI0_D10: P13 CONNECT (MIPI1.17 R18.2), P10 VI Hi3519 (U3.AC7)
M1_D3P_VI0_D9: P13 CONNECT (MIPI1.16 R11.2), P10 VI Hi3519 (U3.AD7)
M2_CKM_VI1_D15: P13 CONNECT (MIPI1.38 R75.2), P10 VI Hi3519 (U3.AB10)
M2_CKP_VI1_D14: P13 CONNECT (MIPI1.37 R74.2), P10 VI Hi3519 (U3.AA10)
M2_D0M_VI1_D8: P13 CONNECT (MIPI1.41 R63.2), P10 VI Hi3519 (U3.AC13)
M2_D0P_VI1_D9: P13 CONNECT (MIPI1.40 R65.2), P10 VI Hi3519 (U3.AD13)
M2_D1M_VI1_D11: P13 CONNECT (MIPI1.35 R67.2), P10 VI Hi3519 (U3.AD12)
M2_D1P_VI1_D10: P13 CONNECT (MIPI1.34 R66.2), P10 VI Hi3519 (U3.AC12)
M2_D2M_VI1_D6: P13 CONNECT (MIPI1.44 R72.2), P10 VI Hi3519 (U3.AA13)
M2_D2P_VI1_D7: P13 CONNECT (MIPI1.43 R62.2), P10 VI Hi3519 (U3.AB13)
M2_D3M_VI1_D13: P13 CONNECT (MIPI1.32 R70.2), P10 VI Hi3519 (U3.AD11)
M2_D3P_VI1_D12: P13 CONNECT (MIPI1.31 R69.2), P10 VI Hi3519 (U3.AC11)
MDCK: P13 CONNECT (J1.168), P09 SYS of Hi3519 (R29.1)
MDIO: P13 CONNECT (J1.170), P09 SYS of Hi3519 (U3.E20)
NetC5_1: P14 LED (C5.1 J15.3 R52.2), P13 CONNECT (J1.201)
NetC6_1: P14 LED (C6.1 J15.2 R372.2), P13 CONNECT (J1.203)
NetJ1_7: P13 CONNECT (J1.7), P10 VI Hi3519 (R265.2 U3.AC2)
NetR245_2: P13 CONNECT (R375.1), P10 VI Hi3519 (R245.2 U3.AD3)
NetR373_1: P13 CONNECT (R373.1), P10 VI Hi3519 (U3.AD2)
NetR374_1: P13 CONNECT (R374.1), P10 VI Hi3519 (U3.AC3)
NetR382_1: P13 CONNECT (R382.1), P11 Peripheral of Hi351 (U3.R24)
NetR385_1: P13 CONNECT (R385.1), P11 Peripheral of Hi351 (U3.N24)
NetR386_1: P13 CONNECT (R386.1), P11 Peripheral of Hi351 (U3.N23)
NetR388_1: P13 CONNECT (R388.1), P11 Peripheral of Hi351 (U3.R23)
NetR389_1: P13 CONNECT (R389.1), P11 Peripheral of Hi351 (U3.P21)
NetR394_1: P13 CONNECT (R394.1), P11 Peripheral of Hi351 (U3.T24)
NetR395_1: P13 CONNECT (R395.1), P10 VI Hi3519 (U3.D24)
NetR396_1: P13 CONNECT (R396.1), P11 Peripheral of Hi351 (U3.T23)
NetR397_1: P13 CONNECT (R397.1), P10 VI Hi3519 (U3.B24)
NetR398_1: P13 CONNECT (R398.1), P10 VI Hi3519 (U3.A23)
RGMII_RXCK: P13 CONNECT (J1.146), P09 SYS of Hi3519 (U3.C19)
RGMII_RXD0: P13 CONNECT (J1.138), P09 SYS of Hi3519 (U3.B17)
RGMII_RXD1: P13 CONNECT (J1.140), P09 SYS of Hi3519 (U3.C17)
RGMII_RXD2: P13 CONNECT (J1.142), P09 SYS of Hi3519 (U3.C18)
RGMII_RXD3: P13 CONNECT (J1.144), P09 SYS of Hi3519 (U3.A19)
RGMII_RXDV: P13 CONNECT (J1.148), P09 SYS of Hi3519 (U3.A17)
RGMII_TXCKOUT: P13 CONNECT (J1.160), P09 SYS of Hi3519 (R23.1)
RGMII_TXD0: P13 CONNECT (J1.152), P09 SYS of Hi3519 (R25.1)
RGMII_TXD1: P13 CONNECT (J1.154), P09 SYS of Hi3519 (R26.1)
RGMII_TXD2: P13 CONNECT (J1.156), P09 SYS of Hi3519 (R27.1)
RGMII_TXD3: P13 CONNECT (J1.158), P09 SYS of Hi3519 (R28.1)
RGMII_TXEN: P13 CONNECT (J1.162), P09 SYS of Hi3519 (R24.1)
UART0_RXD: P14 LED (R372.1), P11 Peripheral of Hi351 (U3.Y18)
UART0_TXD: P14 LED (R52.1), P11 Peripheral of Hi351 (U3.Y19)
UART1_RXD: P13 CONNECT (R384.1), P11 Peripheral of Hi351 (U3.U22)
UART1_TXD: P13 CONNECT (R380.1), P11 Peripheral of Hi351 (U3.T22)
VI1_CLK: P13 CONNECT (J1.102), P10 VI Hi3519 (U3.AC15)
VI1_D0: P13 CONNECT (J1.85), P10 VI Hi3519 (U3.AB15)
VI1_D1: P13 CONNECT (J1.87), P10 VI Hi3519 (U3.AB14)
VI1_D2: P13 CONNECT (J1.89), P10 VI Hi3519 (U3.AD14)
VI1_D3: P13 CONNECT (J1.91), P10 VI Hi3519 (U3.AC14)
VI1_D4: P13 CONNECT (J1.93), P10 VI Hi3519 (U3.AA14)
VI1_D5: P13 CONNECT (J1.95), P10 VI Hi3519 (U3.Y14)